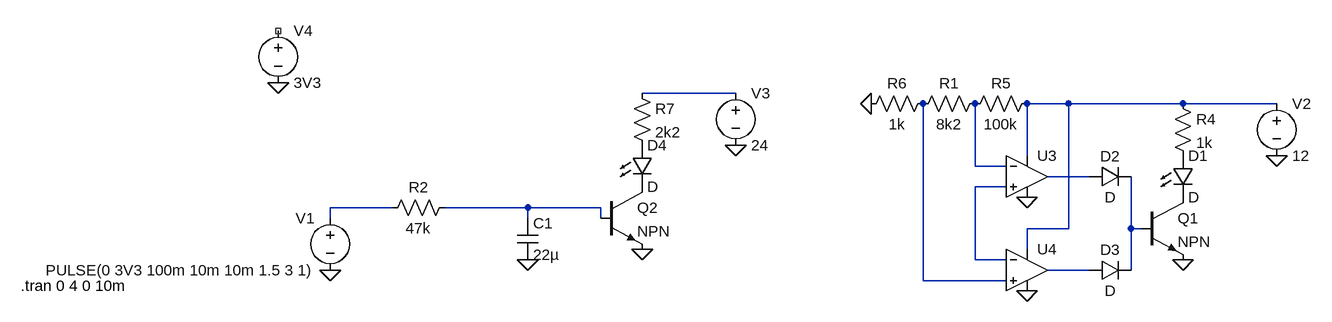
[diagram p0: schematic Draft3.asc]
Draft3.asc, the LTspice schematic file:
Version 4
SHEET 1 1448 680
WIRE 560 -80 416 -80
WIRE 1072 -64 1008 -64
WIRE 1248 -64 1072 -64
WIRE 1392 -64 1248 -64
WIRE 1008 16 1008 -64
WIRE 928 32 928 -64
WIRE 976 32 928 32
WIRE 1104 48 1040 48
WIRE 976 64 928 64
WIRE 32 96 -64 96
WIRE 240 96 112 96
WIRE 352 96 240 96
WIRE -64 112 -64 96
WIRE 240 112 240 96
WIRE 352 112 352 96
WIRE 1072 128 1072 -64
WIRE 1072 128 1008 128
WIRE 1168 128 1168 48
WIRE 1184 128 1168 128
WIRE 1008 160 1008 128
WIRE 928 176 928 64
WIRE 976 176 928 176
WIRE 1104 192 1040 192
WIRE 1168 192 1168 128
WIRE 848 208 848 -64
WIRE 976 208 848 208
FLAG -64 192 0
FLAG 1248 176 0
FLAG 1392 16 0
FLAG 768 -64 0
FLAG 1008 80 0
FLAG 1008 224 0
FLAG 416 160 0
FLAG 560 0 0
FLAG -144 -96 0
FLAG 240 176 0
SYMBOL voltage -64 96 M0
WINDOW 123 0 0 Left 0
WINDOW 39 0 0 Left 0
SYMATTR InstName V1
SYMATTR Value PULSE(0 3V3 100m 10m 10m 1.5 3 1)
SYMBOL npn 1184 80 R0
SYMATTR InstName Q1
SYMBOL LED 1232 16 R0
SYMATTR InstName D1
SYMBOL res 1232 -80 R0
SYMATTR InstName R4
SYMATTR Value 1k
SYMBOL voltage 1392 -80 R0
WINDOW 123 0 0 Left 0
WINDOW 39 0 0 Left 0
SYMATTR InstName V2
SYMATTR Value 12
SYMBOL res 944 -80 R90
WINDOW 0 0 56 VBottom 2
WINDOW 3 32 56 VTop 2
SYMATTR InstName R1
SYMATTR Value 8k2
SYMBOL res 1024 -80 R90
WINDOW 0 0 56 VBottom 2
WINDOW 3 32 56 VTop 2
SYMATTR InstName R5
SYMATTR Value 100k
SYMBOL res 864 -80 R90
WINDOW 0 0 56 VBottom 2
WINDOW 3 32 56 VTop 2
SYMATTR InstName R6
SYMATTR Value 1k
SYMBOL diode 1104 64 R270
WINDOW 0 32 32 VTop 2
WINDOW 3 0 32 VBottom 2
SYMATTR InstName D2
SYMBOL diode 1104 208 R270
WINDOW 0 32 32 VTop 2
WINDOW 3 0 32 VBottom 2
SYMATTR InstName D3
SYMBOL OpAmps\\UniversalOpAmp 1008 48 R0
SYMATTR InstName U3
SYMBOL OpAmps\\UniversalOpAmp 1008 192 R0
SYMATTR InstName U4
SYMBOL LED 400 0 R0
SYMATTR InstName D4
SYMBOL res 400 -96 R0
SYMATTR InstName R7
SYMATTR Value 2k2
SYMBOL voltage 560 -96 R0
WINDOW 123 0 0 Left 0
WINDOW 39 0 0 Left 0
SYMATTR InstName V3
SYMATTR Value 24
SYMBOL npn 352 64 R0
SYMATTR InstName Q2
SYMBOL voltage -144 -192 R0
WINDOW 123 0 0 Left 0
WINDOW 39 0 0 Left 0
SYMATTR InstName V4
SYMATTR Value 3V3
SYMBOL res 128 80 R90
WINDOW 0 0 56 VBottom 2
WINDOW 3 32 56 VTop 2
SYMATTR InstName R2
SYMATTR Value 47k
SYMBOL cap 224 112 R0
SYMATTR InstName C1
SYMATTR Value 22µ
TEXT -540 216 Left 2 !.tran 0 4 0 10m

The netlist it stands for:
* Draft3.asc
V1 N006 0 PULSE(0 3V3 100m 10m 10m 1.5 3 1)
Q1 P001 N008 0 0 NPN
D1 P002 P001 D
R4 N002 P002 1k
V2 N002 0 12
R1 N003 N010 8k2
R5 N002 N003 100k
R6 N010 0 1k
D2 N004 N008 D
D3 N009 N008 D
XU3 N005 N003 N002 0 N004 level1 Avol=1Meg GBW=10Meg Vos=0 En=0 Enk=0 In=0 Ink=0 Rin=500Meg  ; pins In+ In- V+ V- OUT
XU4 N010 N005 N002 0 N009 level1 Avol=1Meg GBW=10Meg Vos=0 En=0 Enk=0 In=0 Ink=0 Rin=500Meg  ; pins In+ In- V+ V- OUT
D4 P003 P004 D
R7 N001 P003 2k2
V3 N001 0 24
Q2 P004 N007 0 0 NPN
V4 NC_01 0 3V3
R2 N007 N006 47k
C1 N007 0 22µ
.model D D
.lib standard.dio
.model NPN NPN
.model PNP PNP
.lib standard.bjt
.tran 0 4 0 10m
.lib UniversalOpAmp1.lib
.backanno
.end